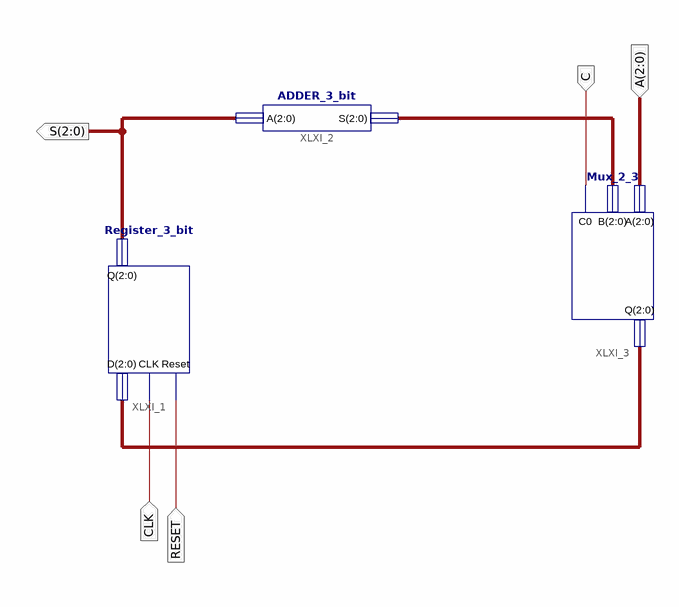
[diagram p0: schematic sheet 1]
// Xilinx ISE schematic PC.sch (spartan3e) as structural Verilog: 3 symbols, 5 ports
module PC (
  input  C,
  input  [2:0] A,
  input  CLK,
  input  RESET,
  output [2:0] S
);

  wire [2:0] XLXN_1, XLXN_3;

  Register_3_bit XLXI_1 (.CLK(CLK), .D(XLXN_1), .Q(S), .Reset(RESET));
  ADDER_3_bit XLXI_2 (.A(S), .S(XLXN_3));
  Mux_2_3 XLXI_3 (.A(A), .B(XLXN_3), .C0(C), .Q(XLXN_1));
endmodule
